# EAGLE design danger_danger_psu-mk-2 (EAGLE 6.5.0)
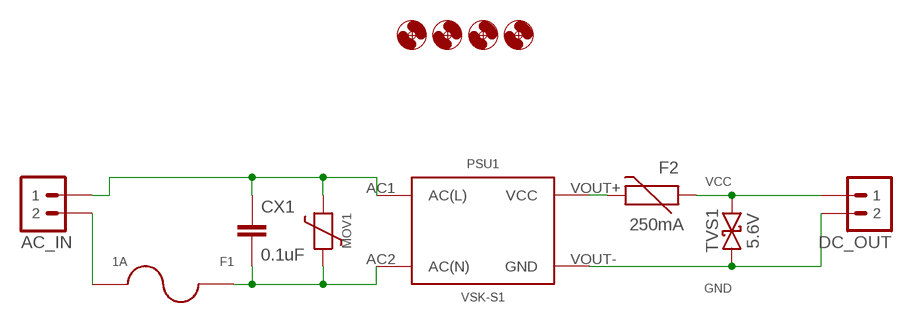
[diagram p0: schematic, sheet 1]

## Parts
AC_IN  M023.5MM  [SCREWTERMINAL-3.5MM-2]
CX1  0.1uF  CXXC10B5  [XC10B5]
DC_OUT  M02JST-PTH-VERT  [JST-2-PH-VERT-PTH]
F1  1A  FUSE5X20MM-2  [FUSE-2AG]
F2  250mA  PTCPTH  [PTC]
H1  HOLE#2  [HOLE-#2]
H2  HOLE#2  [HOLE-#2]
H3  HOLE#2  [HOLE-#2]
H4  HOLE#2  [HOLE-#2]
MOV1  VARISITORVAR-5.08MM-PTH  [VAR-5.08MM-PTH]
PSU1  VSK-S1  [VSK-S1]
TVS1  5.6V  TVSDO-41-10.16MM  [DO-41-TVS-BI-10.16MM]

## Nets
GND: DC_OUT.2 PSU1.VOUT-(GND) TVS1.P$2
N$1: CX1.2 F1.1 F1.1@1 MOV1.2 PSU1.AC2(AC(N))
N$2: AC_IN.1 CX1.1 MOV1.1 PSU1.AC1(AC(L))
N$3: AC_IN.2 F1.2 F1.2@2
N$8: F2.P$2 PSU1.VOUT+(VCC)
VCC: DC_OUT.1 F2.P$1 TVS1.P$1

## Library data of the parts
AC_IN DC_OUT = A_butts:M02: Standard 2-pin 0.1" header. Use with - straight break away headers ( PRT-00116) - right angle break away headers (PRT-00553) - swiss pins (PRT-00743) - machine pins (PRT-00117) - female headers (PRT-00115) Molex polarized connector foot print use with: PRT-08233 with associated crimp pins and housings. 2.54_SCREWTERM for use with PRT-10571. 3.5mm Screw Terminal footprints for PRT-08084 5mm Screw Terminal footprints for use with PRT-08433
CX1 = A_butts:CX: X CAPACITOR for power line
F1 = A_butts:FUSE
F2 = A_butts:PTC: Resettable Fuse PTC Resettable Fuse. Spark Fun Electronics SKU : COM-08357
H1-H4 = A_butts:HOLE: MOUNTING HOLE with drill center marker
MOV1 = A_butts:VARISITOR
PSU1 = A_butts:VSK-S1: VSK-S1 is an AC/DC converter for PCB mounting.
TVS1 = A_butts:TVS: Transient voltage suppressor- prevents ESD on inputs. Ignore package description- MBRA140 is NOT this type of part!!!

## Board
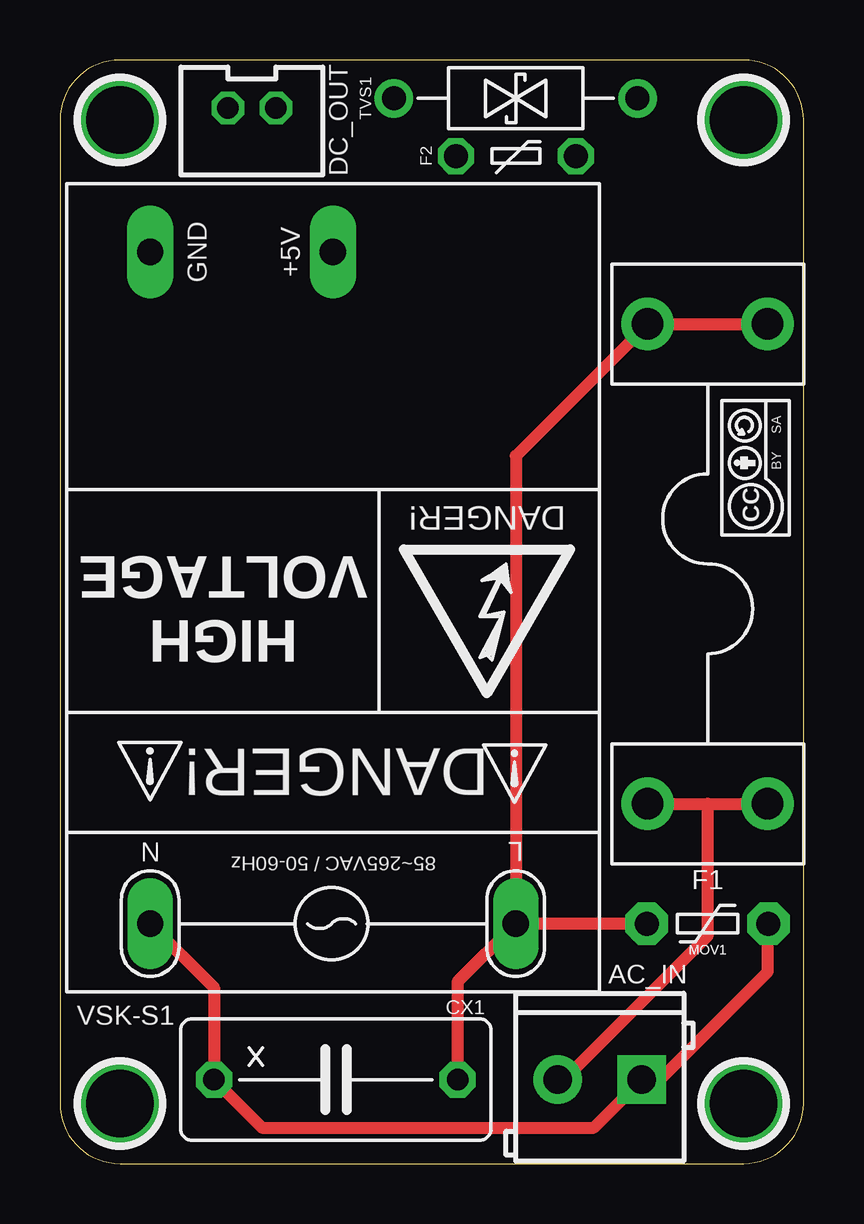
[diagram p1: board, top side]
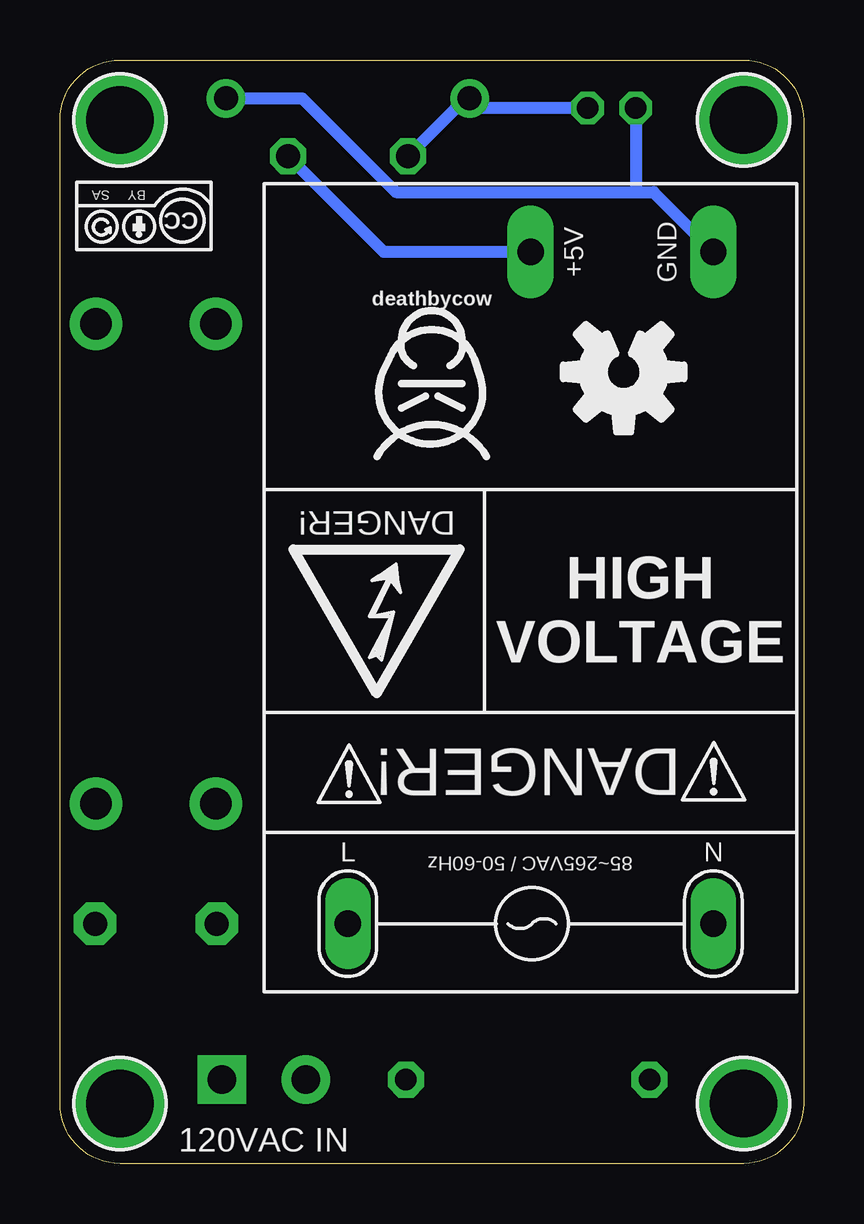
[diagram p2: board, bottom side, seen from below]

Size 31 x 46 mm. Coordinates in mm from the lower left corner, seen from the top.
Outline: 0,43.5 0,2.5 arc90 2.5,0 28.5,0 arc90 31,2.5 31,43.5 arc90 28.5,46 2.5,46 arc90 0,43.5
Copper layers (1*16): Top 0.0356mm / dielectric 1.5011mm / Bottom 0.0356mm
Design rules "LaenPCBOrder_2": minimum track width 6mil, minimum drill 13mil, track to track 6mil, track to pad 6mil, pad to pad 6mil, via to via 6mil, smd to smd 6mil, copper to edge 15mil, drill to drill 6mil, minimum pad ring 7mil, minimum via ring 7mil, stop-mask expansion 3mil, vias tented up to drill 20mil, thermal gap 10mil

### Footprints (pad centres in the part's own frame; a part is rotated, then mirrored left to right if it is on the bottom)
SCREWTERMINAL-3.5MM-2 = drill 1.2 pad 2.032 square: 1 0,0 | drill 1.2 pad 2.032: 2 3.5,0
XC10B5 = drill 0.9 pad 1.5 octagon: 1 -5.08,0; 2 5.08,0
JST-2-PH-VERT-PTH = drill 0.9 octagon: 1 -1,0; 2 1,0
FUSE-2AG = drill 1.3 pad 2.2: 1 -10,2.5; 1@1 -10,-2.5; 2 10,2.5; 2@2 10,-2.5
PTC = drill 1 pad 1.5 octagon: P$1 -2.5,0; P$2 2.5,0
HOLE-#2 = drill 2.8 pad 3.81: P$1 0,0
VAR-5.08MM-PTH = drill 1 pad 1.778 octagon: 1 -2.54,0; 2 2.54,0
VSK-S1 = drill 1.1 pad 1.9 long: AC1 0,15.24; AC2 0,0 | drill 1.1 pad 1.93 long: VOUT+ 28,7.62; VOUT- 28,15.24
DO-41-TVS-BI-10.16MM = drill 1 pad 1.6: P$1 -5.08,0; P$2 5.08,0

### Placement (x,y rotation side)
AC_IN  24.25,3.5 180 top
CX1  11.5,3.5 0 top
DC_OUT  8,44 180 top
F1  27,25 270 top
F2  19,42 0 top
H1  28.5,43.5 0 top
H2  2.5,2.5 0 top
H3  2.5,43.5 0 top
H4  28.5,2.5 0 top
MOV1  27,10 180 top
PSU1  19,10 90 top
TVS1  19,44.4 0 top
U$1  [COW_SMALL]  15.5,32 180 bottom
U$2  [CC-BY-SA-4.0-NO-URL]  29,29 90 top
U$3  [CC-BY-SA-4.0-NO-URL]  27.5,39.5 180 bottom
U$4  [OSHWLOGO_BOT_0.2]  7.5,33 180 top

### Tracks (layer width: path | path; a pad name or v marks a point on that pad's centre or on a via)
GND
  Bottom 0.5: TVS1.P$2 20.9,44.4 17,40.5 7,40.5 | 7,40.5 6.26,40.5 PSU1.VOUT- | DC_OUT.2 7,40.5
N$1
  Top 0.5: F1.1 F1.1@1 19,29.5 PSU1.AC2 | PSU1.AC2 16.58,7.58 CX1.2 | MOV1.2 PSU1.AC2
N$2
  Top 0.5: MOV1.1 29.5,9.96 29.5,8 25,3.5 AC_IN.1 22.25,1.5 8.42,1.5 CX1.1 6.42,7.34 PSU1.AC1
N$3
  Top 0.5: 27,15 27,9.5 21,3.5 AC_IN.2 | 27,15 F1.2 | F1.2@2 27,15
N$8
  Bottom 0.5: PSU1.VOUT+ 17.5,38 F2.P$2
VCC
  Bottom 0.5: DC_OUT.1 14,44 | 14,44 14.5,44 F2.P$1 | TVS1.P$1 13.92,44.08 14,44

### Text on the board
bPlace: 120VAC IN